# Altium schematic sheet New Member Design Schematic.SchDoc
size A
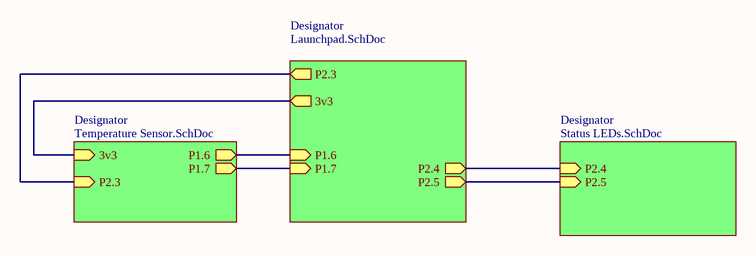
[diagram p0: New Member Design Schematic.SchDoc]

## Sub-sheets
Designator = Launchpad.SchDoc: P2.4 (out), P2.5 (out), P1.6 (in), P1.7 (in), P2.3 (out), 3v3 (out)
Designator = Temperature Sensor.SchDoc: P1.6 (out), P1.7 (out), 3v3 (in), P2.3 (in)
Designator = Status LEDs.SchDoc: P2.4 (in), P2.5 (in)

## Nets
(unnamed): sheet Designator/P2.4, sheet Designator/P2.4
(unnamed): sheet Designator/P2.5, sheet Designator/P2.5
(unnamed): sheet Designator/P1.6, sheet Designator/P1.6
(unnamed): sheet Designator/P1.7, sheet Designator/P1.7
(unnamed): sheet Designator/P2.3, sheet Designator/P2.3
(unnamed): sheet Designator/3v3, sheet Designator/3v3